# Altium schematic sheet PDN Analyzer.SchDoc: Main Schematic
size 287 x 198 mm; DocumentNumber: 1; Revision: 1.0; SheetNumber: 1; SheetTotal: 1
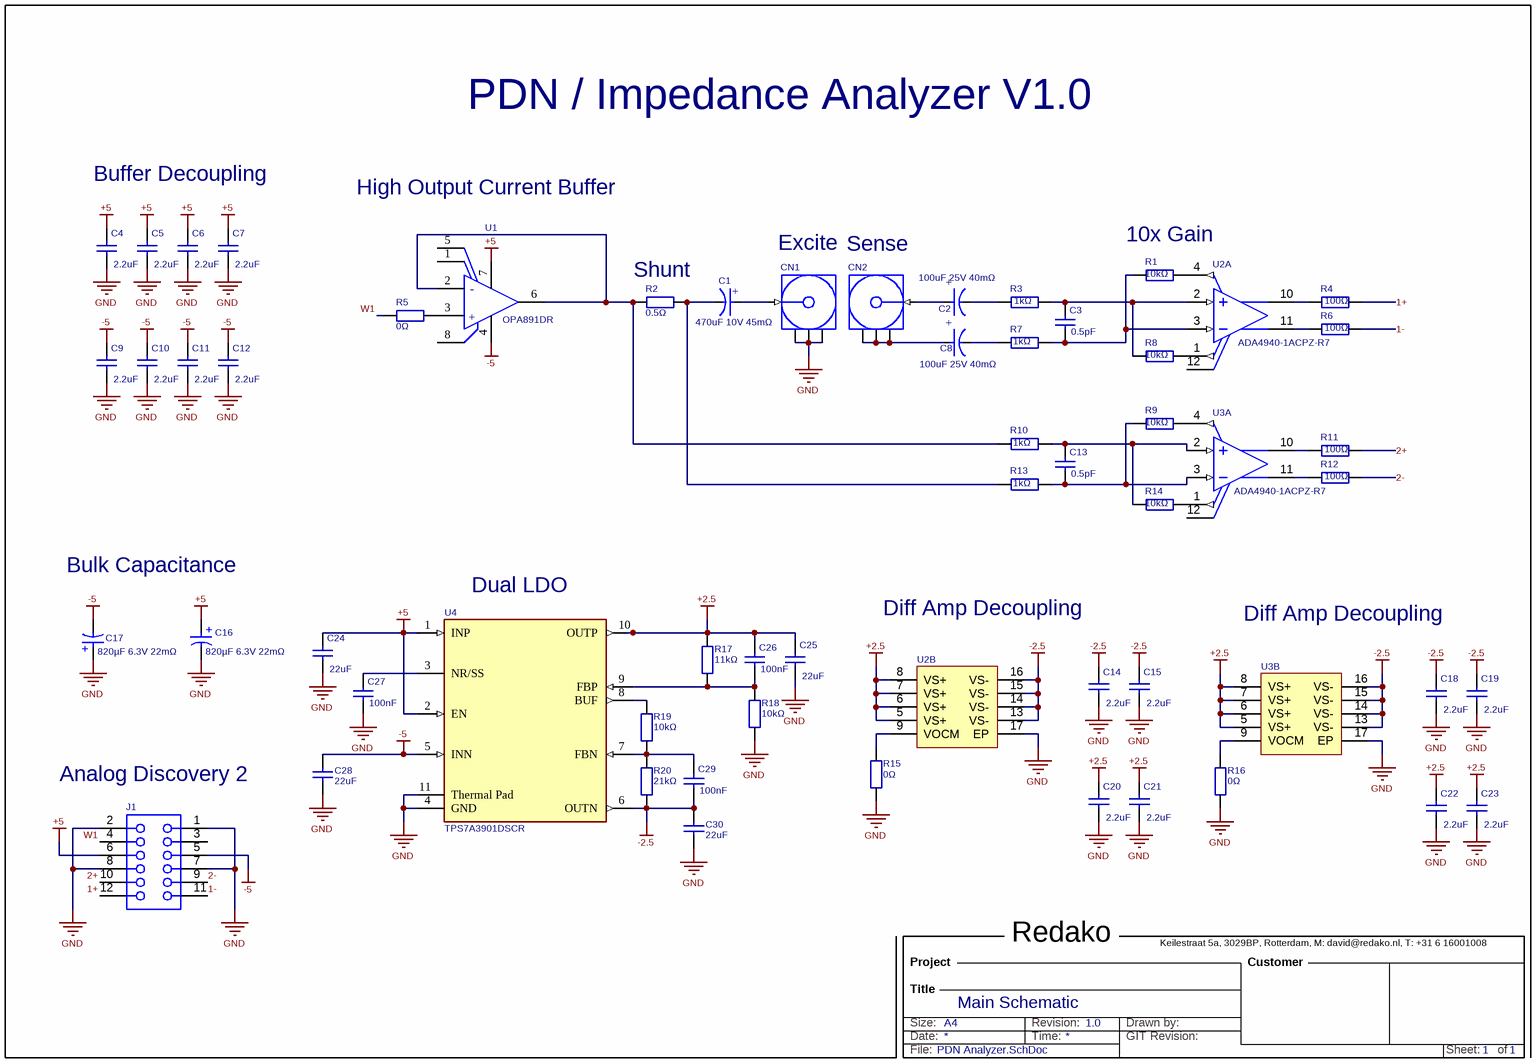
[diagram p0: PDN Analyzer.SchDoc]

## Parts
C1  value 470uF 10V 45mΩ  [FP-T491X107K025AT-MFG]  (hidden comment: C4944894)
C2  value 100uF 25V 40mΩ  [FP-T521X-MFG]  (hidden comment: C696814)
C3  value 0.5pF  [CAPC1005X05N]
C4  value 2.2uF  [CAPC1005X05N]
C5  value 2.2uF  [CAPC1005X05N]
C6  value 2.2uF  [CAPC1005X05N]
C7  value 2.2uF  [CAPC1005X05N]
C8  value 100uF 25V 40mΩ  [FP-T521X-MFG]  (hidden comment: C696814)
C9  value 2.2uF  [CAPC1005X05N]
C10  value 2.2uF  [CAPC1005X05N]
C11  value 2.2uF  [CAPC1005X05N]
C12  value 2.2uF  [CAPC1005X05N]
C13  value 0.5pF  [CAPC1005X05N]
C14  value 2.2uF  [CAPC1005X05N]
C15  value 2.2uF  [CAPC1005X05N]
C16  value 820µF 6.3V 22mΩ  [WCAP-PSLP_D6.3H5.8]  (hidden comment: C5246508)
C17  value 820µF 6.3V 22mΩ  [WCAP-PSLP_D6.3H5.8]  (hidden comment: C5246508)
C18  value 2.2uF  [CAPC1005X05N]
C19  value 2.2uF  [CAPC1005X05N]
C20  value 2.2uF  [CAPC1005X05N]
C21  value 2.2uF  [CAPC1005X05N]
C22  value 2.2uF  [CAPC1005X05N]
C23  value 2.2uF  [CAPC1005X05N]
C24  value 22uF  [CAPC1005X05N]
C25  value 22uF  [CAPC1005X05N]
C26  value 100nF  [CAPC1005X05N]
C27  value 100nF  [CAPC1005X05N]
C28  value 22uF  [CAPC1005X05N]
C29  value 100nF  [CAPC1005X05N]
C30  value 22uF  [CAPC1005X05N]
CN1  C434806  [MOLX-73412-0110_V]  (value not drawn)
CN2  C434806  [MOLX-73412-0110_V]  (value not drawn)
J1  C5333437  [613012243121]  (value not drawn)
R1  value 10kΩ  [RESC1005X04N]
R2  value 0.5Ω  [RESC1608X04N]
R3  value 1kΩ  [RESC1005X04N]
R4  value 100Ω  [RESC1005X04N]
R5  value 0Ω  [RESC1608X04N]
R6  value 100Ω  [RESC1005X04N]
R7  value 1kΩ  [RESC1005X04N]
R8  value 10kΩ  [RESC1005X04N]
R9  value 10kΩ  [RESC1005X04N]
R10  value 1kΩ  [RESC1005X04N]
R11  value 100Ω  [RESC1005X04N]
R12  value 100Ω  [RESC1005X04N]
R13  value 1kΩ  [RESC1005X04N]
R14  value 10kΩ  [RESC1005X04N]
R15  value 0Ω  [RESC1005X04N]
R16  value 0Ω  [RESC1005X04N]
R17  value 11kΩ  [RESC1005X04N]
R18  value 10kΩ  [RESC1005X04N]
R19  value 10kΩ  [RESC1005X04N]
R20  value 21kΩ  [RESC1005X04N]
U1  MPN: OPA891DR  [FP-D0008A-MFG]  (hidden comment: C22444686)
U2  MPN: ADA4940-1ACPZ-R7  [ADI-CP-16-2_M]  (hidden comment: C468516)  (parts A,B of 2)
U3  MPN: ADA4940-1ACPZ-R7  [ADI-CP-16-2_M]  (hidden comment: C468516)  (parts A,B of 2)
U4  TPS7A3901DSCR  [FP-DSC0010J-MFG]

## Nets
+2.5: C20.2 C21.2 C22.2 C23.2 C25.2 C26.2 R17.2 U2.5(VS+) U2.6(VS+) U2.7(VS+) U2.8(VS+) U3.5(VS+) U3.6(VS+) U3.7(VS+) U3.8(VS+) U4.10(OUTP)
+5: C4.2 C5.2 C6.2 C7.2 C16.1(P) C24.2 J1.6 U1.7(VCC+) U4.1(INP) U4.2(EN)
-2.5: C14.2 C15.2 C18.2 C19.2 C29.1 C30.1 R20.1 U2.13(VS-) U2.14(VS-) U2.15(VS-) U2.16(VS-) U3.13(VS-) U3.14(VS-) U3.15(VS-) U3.16(VS-) U4.6(OUTN)
-5: C9.2 C10.2 C11.2 C12.2 C17.2(N) C28.1 J1.5 U1.4(VCC-) U4.5(INN)
GND: C4.1 C5.1 C6.1 C7.1 C9.1 C10.1 C11.1 C12.1 C14.1 C15.1 C16.2(N) C17.1(P) C18.1 C19.1 C20.1 C21.1 C22.1 C23.1 C24.1 C25.1 C27.1 C28.2 C30.2 CN1.2(GND) CN1.3(GND) CN1.4(GND) J1.1 J1.2 J1.7 J1.8 R15.2 R16.2 R18.2 U2.17(EP) U3.17(EP) U4.4(GND) U4.11(Thermal_Pad)
1+: J1.12 R4.1
1-: J1.11 R6.1
2+: J1.10 R11.1
2-: J1.9 R12.1
W1: J1.4 R5.2
NetC1_1: C1.1(C) R2.1 R13.2
NetC1_2: C1.2(A) CN1.1(SIGNAL)
NetC2_1: C2.1(C) R3.2
NetC2_2: C2.2(A) CN2.1(SIGNAL)
NetC3_1: C3.1 R1.2 R7.1 U2.3(IN-)
NetC3_2: C3.2 R3.1 R8.2 U2.2(IN+)
NetC8_1: C8.1(C) R7.2
NetC8_2: C8.2(A) CN2.2(GND) CN2.3(GND) CN2.4(GND)
NetC13_1: C13.1 R9.2 R13.1 U3.3(IN-)
NetC13_2: C13.2 R10.1 R14.2 U3.2(IN+)
NetC26_1: C26.1 R17.1 R18.1 U4.9(FBP)
NetC27_2: C27.2 U4.3(NR/SS)
NetC29_2: C29.2 R19.1 R20.2 U4.7(FBN)
NetR1_1: R1.1 U2.4(FB+)
NetR2_2: R2.2 R10.2 U1.2(IN-) U1.6(OUT)
NetR4_2: R4.2 U2.10(OUT+)
NetR5_1: R5.1 U1.3(IN+)
NetR6_2: R6.2 U2.11(OUT-)
NetR8_1: R8.1 U2.1(FB-)
NetR9_1: R9.1 U3.4(FB+)
NetR11_2: R11.2 U3.10(OUT+)
NetR12_2: R12.2 U3.11(OUT-)
NetR14_1: R14.1 U3.1(FB-)
NetR15_1: R15.1 U2.9(VOCM)
NetR16_1: R16.1 U3.9(VOCM)
NetR19_2: R19.2 U4.8(BUF)

Not connected (* = marked no-connect by the designer): J1 3; U1 1(1_NULL) 5(NC) 8(2_NULL); U2 12(~{DISABLE}); U3 12(~{DISABLE})

## Notes on the sheet
- PDN / Impedance Analyzer V1.0
- Buffer Decoupling
- (near U1) High Output Current Buffer
- Excite
- Sense
- 10x Gain
- (near R2) Shunt
- Bulk Capacitance
- (near U4) Dual LDO
- Diff Amp Decoupling
- (near J1) Analog Discovery 2
- Redako
- Keilestraat 5a, 3029BP, Rotterdam, M: david@redako.nl, T: +31 6 16001008
- Project
- Title
- Customer
- Size:
- Date:
- File:
- A4
- Revision:
- Time:
- Drawn by:
- GIT Revision:
- Sheet:
- of
- (in symbol CMP-00370-145502426-1) -; +
- (in symbol CMP-2000-07204-2) +
- (in symbol CMP-03017-000004-1) +
- (in symbol CMP-03913-53758731-1) +

## Library data of the parts
C1 = CMP-2000-07204-2: CAP TANT 100UF 10% 25V 2917; Dielectric: Tantalum; JLCPCB: C4944894
C2 C8 = CMP-03017-000004-1: CAP TANT POLY 100UF 25V 2917; Dielectric: Tantalum; JLCPCB: C696814
C3-C7 C9-C15 C18-C30 = SMD_Cap: Package: 0402
C16 C17 = CMP-03913-53758731-1: 875105144008 WCAP-PSLP Aluminum Polymer Capacitors; MPN: HV0J827M0607PZ; Dielectric: Polymer; JLCPCB: C5246508
CN1 CN2 = CMP-1676-00003-1: MCRF, PCB Vertical Jack Receptacle, 50 Ohm, 4-Pin SMD, RoHS, Tape and Reel; MPN: 73412-0110; Manufacturer: Molex; JLC Type: Extended; JLCPCB: C434806
J1 = CMP-1502-01425-3: MPN: A2541HWR-2x6P; JLCPCB: C5333437
R1-R20 = Res
  R1 R3 R4 R6-R14 R17-R20: Package: 0402
  R2 R5 R15 R16: Package: 0603
U1 = CMP-00370-145502426-1: OPA891DR 180-MHz 0.95-nV√Hz operational amplifier with ultra-low total harmonic distortion (THD) 8-SOIC -40 to 85; Manufacturer: Texas Instruments; JLCPCB: C22444686
U2 U3 = CMP-1348-00001-1: Ultralow Power, Low Distortion Fully Differential ADC Driver, 3 to 7 V, -40 to 125 degC, 16-Pin LFCSP_VQ (CP-16-2), RoHS, Reel; Manufacturer: Analog Devices; JLCPCB: C468516
U4 = CMP-04917-000133-1: IC REG LINEAR POS/NEG ADJ 10WSON; MPN: TPS7A3901DSCR; JLCPCB: C2685819